# EAGLE schematic Analog_DP_V2 (EAGLE 9.7.0)
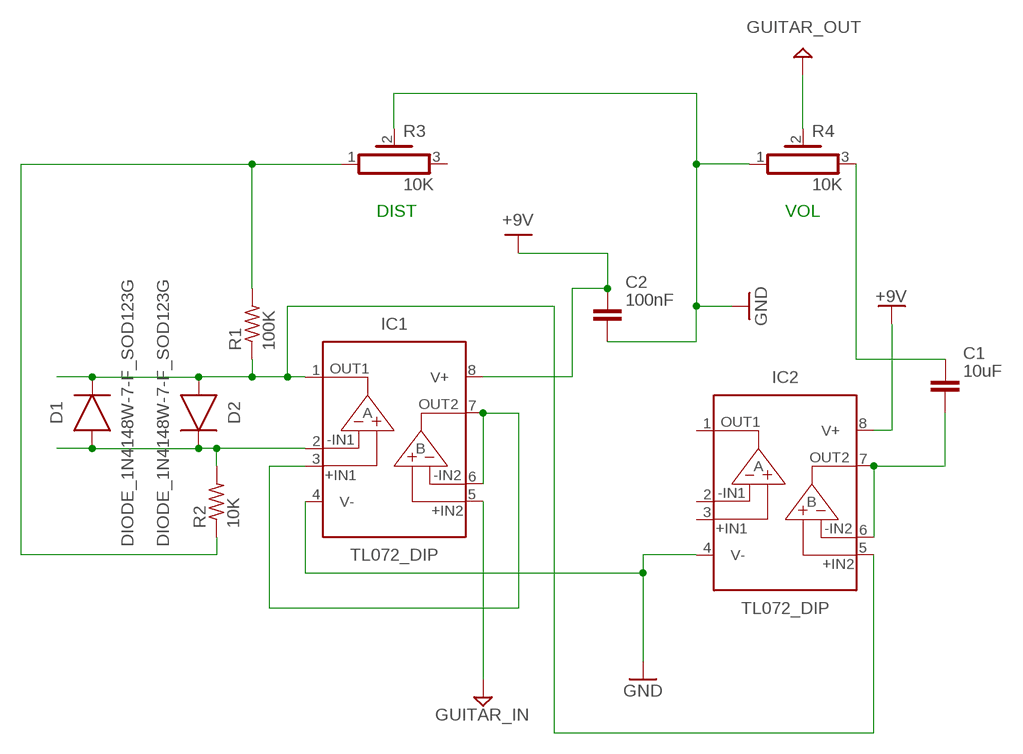
[diagram p0: schematic, sheet 1]

## Parts
C1  10uF  C_RADIAL-55.5MM-DIA  [CAPRD2261W240D5080H5555B]
C2  100nF  C_RADIAL-55.5MM-DIA  [CAPRD2261W240D5080H5555B]
D1  DIODE_1N4148W-7-F_SOD123G  [SOD3715X135]
D2  DIODE_1N4148W-7-F_SOD123G  [SOD3715X135]
IC1  TL072_DIP  [DIP826W53P254L959H508Q8B]
IC2  TL072_DIP  [DIP826W53P254L959H508Q8B]
R1  100K  R-US_AXIAL-7.2MM-PITCH  [RESAD724W46L381D178B]
R2  10K  R-US_AXIAL-7.2MM-PITCH  [RESAD724W46L381D178B]
R3  10K  POT_PV36Y  [PV36Y]
R4  10K  POT_PV36Y  [PV36Y]

## Nets
+9V: C2.1 IC1.8(V+) IC2.8(V+)
GND: C2.2 IC1.4(V-) IC2.4(V-) R3.2 R4.1
N$1: IC1.3(+IN1) IC1.6(-IN2) IC1.7(OUT2)
N$2: C1.2 IC2.6(-IN2) IC2.7(OUT2)
N$3: D1.1(C) D2.2(A) IC1.1(OUT1) IC2.5(+IN2) R1.1
N$4: D1.2(A) D2.1(C) IC1.2(-IN1) R2.2
N$5: C1.1 R4.3
N$6: R4.2 ; supply symbol labelled GUITAR_OUT
N$7: R1.2 R2.1 R3.1
N$8: IC1.5(+IN2) ; supply symbol labelled GUITAR_IN
Unconnected: IC2.1(OUT1) IC2.2(-IN1) IC2.3(+IN1) R3.3

## Notes on the sheet
- DIST | VOL

## Library data of the parts
C1 C2 = Tutorial - Fusion 360:C: Capacitor - Generic; CATEGORY: Capacitor
D1 D2 = Diode:DIODE_: Diode Rectifier - Popular parts; CATEGORY: Diode; DATASHEET: https://www.diodes.com/datasheet/download/1N4148W.pdf; DESCRIPTION: Diode 100 V 300mA Surface Mount SOD-123; FORWARD_CURRENT: 150mA; FORWARD_VOLTAGE: 1.25V; MANUFACTURER: Diodes Incorporated; MPN: 1N4148W-7-F; OPERATING_TEMPERATURE: -55°C ~ 150°C; PACKAGE_SIZE: SOD-123; PACKAGE_TYPE: SMD; PART_STATUS: ACTIVE; REVERSE_VOLTAGE: 100V; ROHS: COMPLIANT; SERIES: 1N4148; SUBCATEGORY: Rectifiers; TYPE: Small Signal Switching Diodes; ZENER_VOLTAGE: NA
IC1 IC2 = IC_Linear:TL072: FET-Input Operational Amplifiers Reference Datasheet <https://www.ti.com/lit/ds/symlink/tl072.pdf?ts=1645679391516&ref_url=https%253A%252F%252Fwww.google.com%252F>; CATEGORY: Amplifier; DESCRIPTION: FET-Input Operational Amplifiers; MANUFACTURER: Generic; MPN: Generic; SERIES: TL072; SUB-CATEGORY: OpAmp; TYPE: FET-Input
R1 R2 = Tutorial - Fusion 360:R-US: Resistor Fixed - ANSI; CATEGORY: Resistor; SUB-CATEGORY: Fixed
R3 R4 = Tinkercad:POT: Rectangular Trimmer Potentiometers - PV36 Series Datasheet <https://www.bourns.com/docs/Product-Datasheets/pv36.pdf>; CATEGORY: Resistor; DESCRIPTION: Lead Sealed Type Multiturn PV36 Series; MANUFACTURER: BOURNS; MPN: PV36Y; OPERATING_TEMPERATURE: -55 to +125 °C; PART_STATUS: Active; ROHS_COMPLIANCE: ROHS Compliant; SERIES: PV36; SUB-CATEGORY: Trimpot; TYPE: Lead Sealed